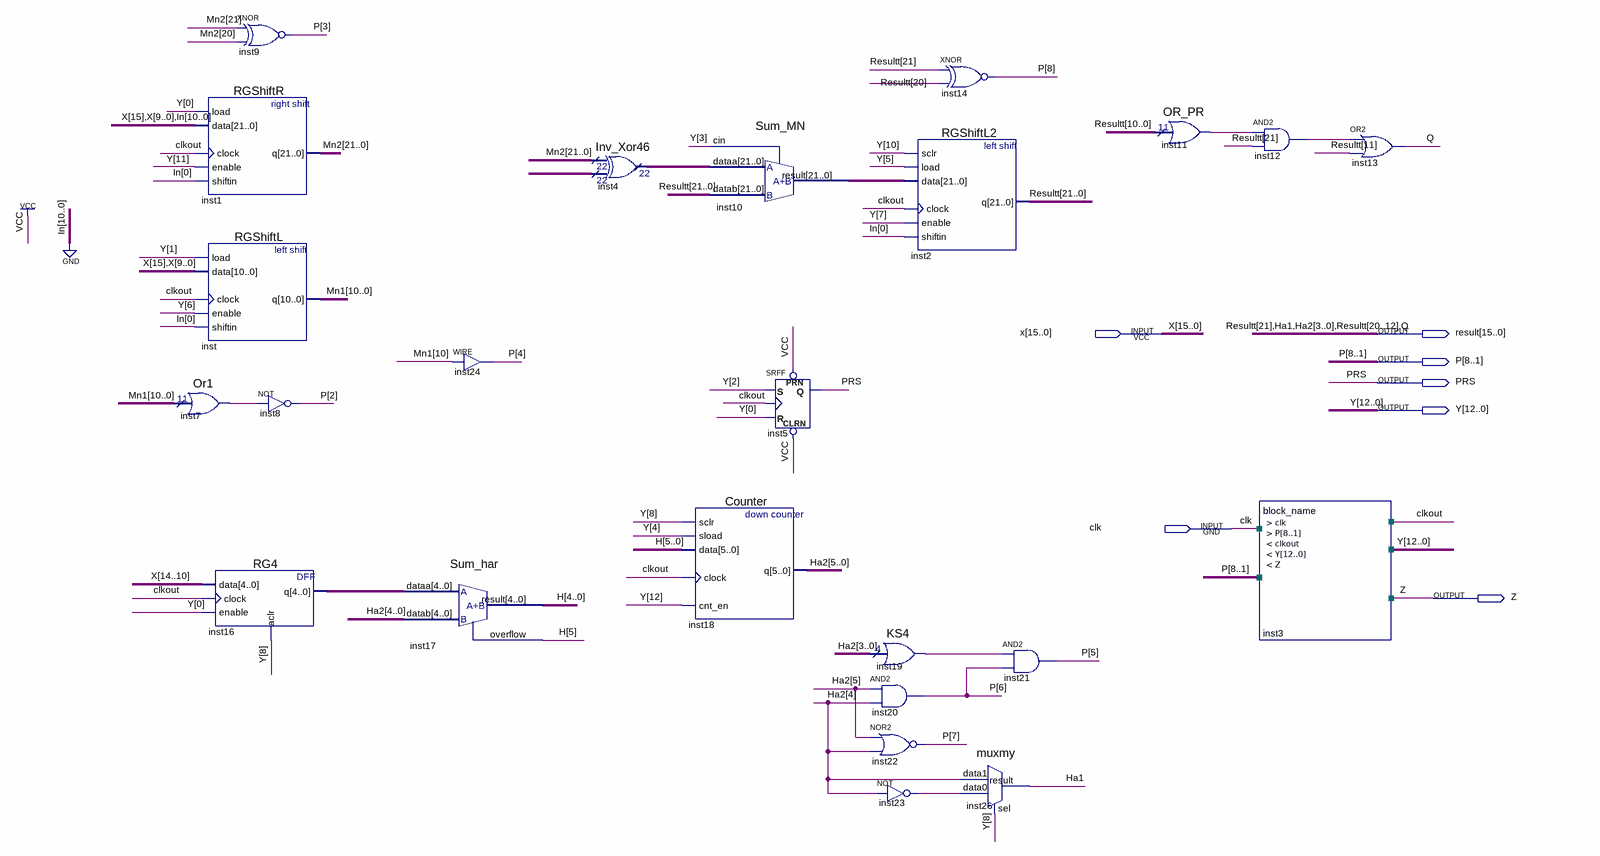
[diagram p0: schematic sheet]
// Quartus schematic OA.bdf as structural Verilog: 24 symbols, 7 pins
module OA (
  input  [15:0] x,
  input  clk,
  output [15:0] result,
  output [8:1] P,
  output PRS,
  output [12:0] Y,
  output Z
);

  wire clkout, inst7_result, inst11_result, inst12_out, inst19_result, inst23_out;
  wire [4:0] inst16_q;
  wire [5:0] H;
  wire [5:4] Ha2;
  wire [10:0] Mn1;
  wire [11:0] Resultt;
  wire [21:0] inst4_result, inst10_result, Mn2;

  RGShiftR inst1 (
    .load(Y[0]), .data({x[15], x[9:0], {11{1'b0}}}), .clock(clkout), .enable(Y[11]), .shiftin(1'b0), .q(Mn2));
  RGShiftL inst (.load(Y[1]), .data({x[15], x[9:0]}), .clock(clkout), .enable(Y[6]), .shiftin(1'b0), .q(Mn1));
  Or1 inst7 (.data(Mn1), .result(inst7_result));
  RG4 inst16 (.data(x[14:10]), .clock(clkout), .enable(Y[0]), .aclr(Y[8]), .q(inst16_q));
  xnor inst9 (P[3], Mn2[21], Mn2[20]);
  not inst8 (P[2], inst7_result);
  Sum_har inst17 (.dataa(inst16_q), .datab({Ha2[4], result[13:10]}), .result(H[4:0]), .overflow(H[5]));
  assign P[4] = Mn1[10];  // WIRE inst24
  Inv_Xor46 inst4 (.data0x(Mn2), .data1x({22{Y[3]}}), .result(inst4_result));
  Sum_MN inst10 (.dataa(inst4_result), .datab({result[15], result[9:1], Resultt}), .cin(Y[3]), .result(inst10_result));
  Counter inst18 (.sclr(Y[8]), .sload(Y[4]), .data(H), .clock(clkout), .cnt_en(Y[12]), .q({Ha2, result[13:10]}));
  SRFF inst5 (.PRN(1'b1), .CLRN(1'b1), .S(Y[2]), .R(Y[0]), .CLK(clkout), .Q(PRS));
  KS4 inst19 (.data(result[13:10]), .result(inst19_result));
  and inst20 (P[6], Ha2[5], Ha2[4]);
  nor inst22 (P[7], Ha2[5], Ha2[4]);
  not inst23 (inst23_out, Ha2[4]);
  xnor inst14 (P[8], result[15], result[9]);
  RGShiftL2 inst2 (
    .sclr(Y[10]), .load(Y[5]), .data(inst10_result), .clock(clkout), .enable(Y[7]), .shiftin(1'b0),
    .q({result[15], result[9:1], Resultt}));
  muxmy inst26 (.data1(Ha2[4]), .data0(inst23_out), .sel(Y[8]), .result(result[14]));
  and inst21 (P[5], inst19_result, P[6]);
  OR_PR inst11 (.data(Resultt[10:0]), .result(inst11_result));
  and inst12 (inst12_out, inst11_result, result[15]);
  block_name inst3 (.clk(clk), .P(P), .clkout(clkout), .Y(Y), .Z(Z));
  or inst13 (result[0], inst12_out, Resultt[11]);

  // Other names for the same wires on the sheet: Ha1 = result[14]; Ha2[3:0] = result[13:10]; Q = result[0];
  //   Resultt[21:12] = {result[15], result[9:1]}
endmodule
